# Altium schematic sheet tx_path.SchDoc: WULPUS PRO
size A4; DrawnBy: Sergei Vostrikov; Organization: Integrated Systems Laboratory; Revision: 1.0.0; SheetNumber: 3; SheetTotal: 8
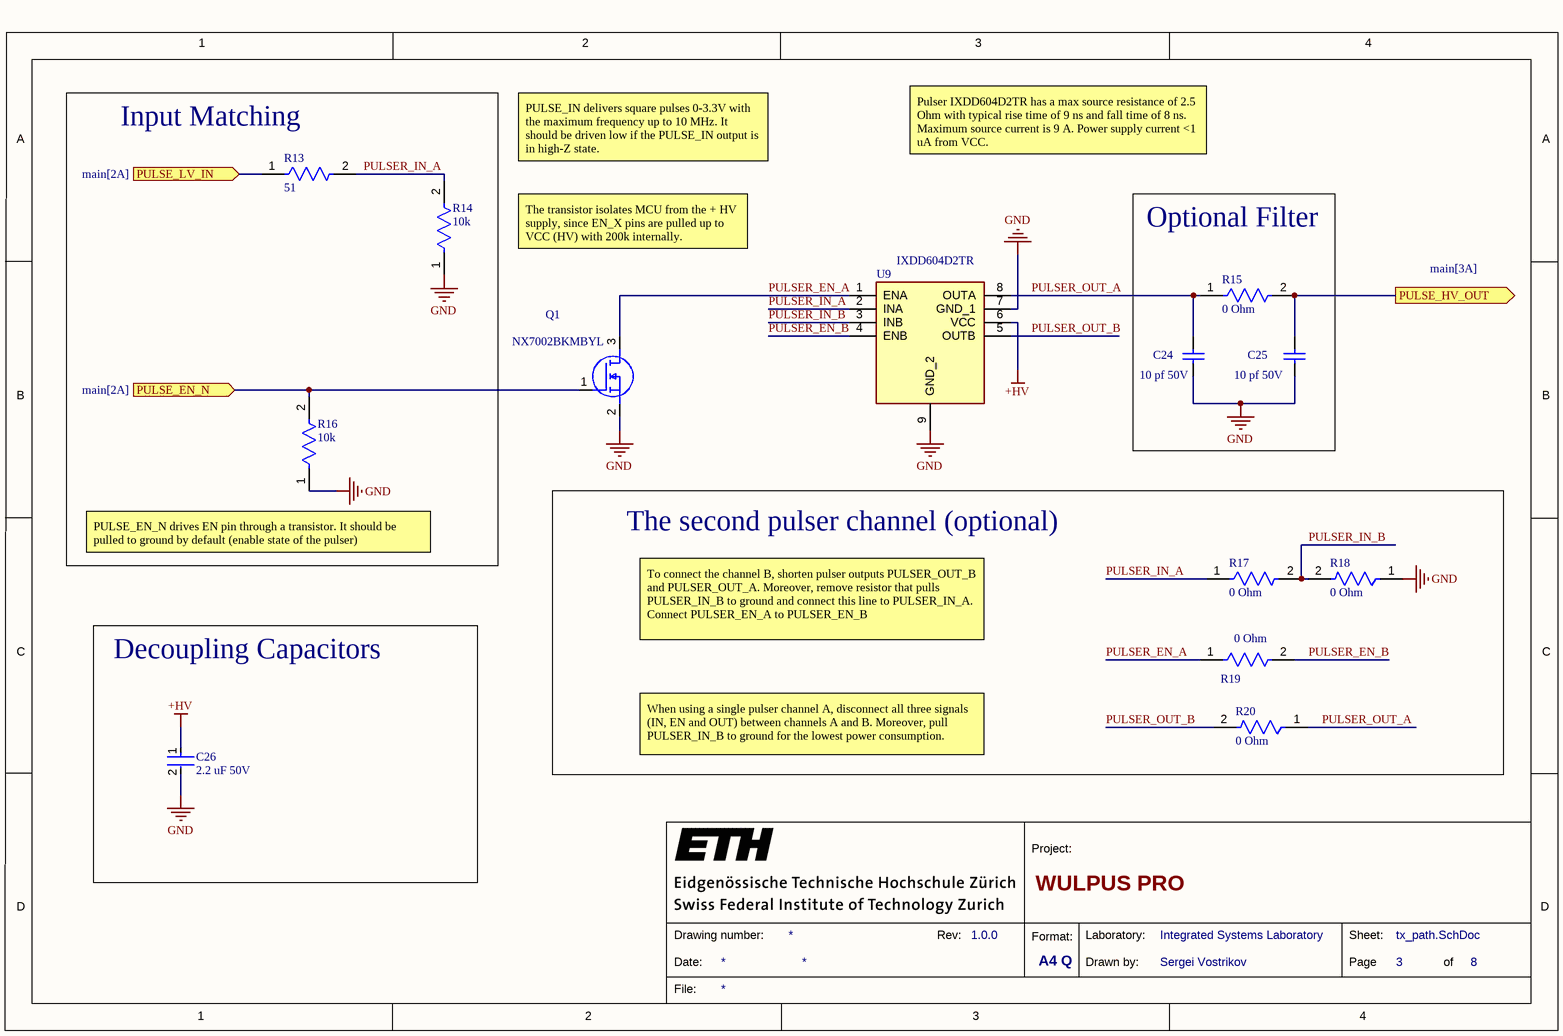
[diagram p0: tx_path.SchDoc]

## Parts
C24  10 pf 50V  [CAPC1005X55X25LL05T10]
C25  10 pf 50V  [CAPC1005X55X25LL05T10]
C26  2.2 uF 50V  [FP-GRM188-0_2-IPC_B]
Q1  NX7002BKMBYL  [NX7002BKMBYL]
R13  51  [FP-CRCW0402-e3-IPC_C]
R14  10k  [FP-CRCW0402-e3-IPC_B]
R15  0 Ohm  [FP-ERJ-3GEY0R00V-MFG]
R16  10k  [FP-CRCW0402-e3-IPC_B]
R17  0 Ohm  [FP-CRCW0402-e3-IPC_C]
R18  0 Ohm  [FP-CRCW0402-e3-IPC_C]
R19  0 Ohm  [FP-CRCW0402-e3-IPC_C]
R20  0 Ohm  [FP-CRCW0402-e3-IPC_C]
U9  IXDD604D2TR  [SON95P500X400X100-9N]

## Blocks framed on the sheet
Input Matching: R13 R14 R16
Optional Filter: C24 C25 R15
The second pulser channel (optional): R17-R20
Decoupling Capacitors: C26

## Ports
PULSE_EN_N (in, see main[2A]), PULSE_HV_OUT (out, see main[3A]), PULSE_LV_IN (in, see main[2A])

## Nets
+HV: C26.1 U9.6(VCC)
GND: C24.1 C25.1 C26.2 Q1.2(S) R14.1 R16.1 R18.1 U9.7(GND_1) U9.9(GND_2)
PULSE_EN_N: Q1.1(G) R16.2 ; port PULSE_EN_N
PULSE_HV_OUT: C25.2 R15.2 ; port PULSE_HV_OUT
PULSE_LV_IN: R13.1 ; port PULSE_LV_IN
PULSER_EN_A: Q1.3(D) R19.1 U9.1(ENA)
PULSER_EN_B: R19.2 U9.4(ENB)
PULSER_IN_A: R13.2 R14.2 R17.1 U9.2(INA)
PULSER_IN_B: R17.2 R18.2 U9.3(INB)
PULSER_OUT_A: C24.2 R15.1 R20.1 U9.8(OUTA)
PULSER_OUT_B: R20.2 U9.5(OUTB)

## Notes on the sheet
- PULSE_IN delivers square pulses 0-3.3V with the maximum frequency up to 10 MHz. It should be driven low if the PULSE_IN output is in high-Z state.
- Pulser IXDD604D2TR has a max source resistance of 2.5 Ohm with typical rise time of 9 ns and fall time of 8 ns. Maximum source current is 9 A. Power supply current <1 uA from VCC.
- The transistor isolates MCU from the + HV supply, since EN_X pins are pulled up to VCC (HV) with 200k internally.
- (near R16) PULSE_EN_N drives EN pin through a transistor. It should be pulled to ground by default (enable state of the pulser)
- To connect the channel B, shorten pulser outputs PULSER_OUT_B and PULSER_OUT_A. Moreover, remove resistor that pulls PULSER_IN_B to ground and connect this line to PULSER_IN_A. Connect PULSER_EN_A to PULSER_EN_B
- When using a single pulser channel A, disconnect all three signals (IN, EN and OUT) between channels A and B. Moreover, pull PULSER_IN_B to ground for the lowest power consumption.
- 1
- 2
- 3
- 4
- A
- B
- C
- Project:
- D
- Date:
- Drawing number:
- Rev:
- Format:
- A4 Q
- Drawn by:
- Laboratory:
- Page
- Sheet:
- of
- File:

## Library data of the parts
C24 C25 = CMP-2008-04245-1: GRM1555C1H100JA01D; Manufacturer: Murata; Part Number: GRM1555C1H100JA01D
C26 = CMP-06035-000704-1: GRM188R61H225ME11D; Capacitance: 2.2uF; Dielectric: X5R; Tolerance: 20%; Weight: 0.000222oz; Min Operating Temperature: -55°C; Voltage Rating (DC): 50V; Case Code (Imperial): 0603; Thickness: 0.039inch; Height: 0.8mm; Termination: SMD/SMT; Resistor Type: Ceramic; Case/Package: 0603; Package Quantity: 4000; Length: 0.063inch; Lead Free: Lead Free; Max Operating Temperature: 85°C; Packaging: Tape and Reel; Width: 0.031inch; Voltage Rating: 50V; Mount: Surface Mount; Case Code (Metric): 1608
Q1 = NX7002BKMBYL: MOSFET (N-Channel); Manufacturer_Name: Nexperia; Datasheet Link: https://assets.nexperia.com/documents/data-sheet/NX7002BKMB.pdf; Height: 0.4mm; Manufacturer_Part_Number: NX7002BKMBYL; Mouser Part Number: 771-NX7002BKMBYL; Mouser Price/Stock: https://www.mouser.co.uk/ProductDetail/Nexperia/NX7002BKMBYL?qs=%252BRKXB2WKlSdBDdfwQeVqTQ%3D%3D; Arrow Part Number: NX7002BKMBYL; Arrow Price/Stock: https://www.arrow.com/en/products/nx7002bkmbyl/nexperia?region=nac
R13 = CMP-2002-00083-2: CRCW040251R0JNED; Max Power Dissipation: 63mW; Temperature Coefficient: 200ppm/°C; Tolerance: 5%; Resistance: 51R; Voltage Rating: 50V; Depth: 0.5mm; Mount: Surface Mount; Number of Terminations: 2; Height: 0.35mm; Length: 1mm; Case Code (Metric): 1005; Radiation Hardening: No; Min Operating Temperature: -55°C; Termination: SMD/SMT; Military Standard: Not; Lead Free: Lead Free; Power Rating: 63mW; Max Operating Temperature: 155°C; Width: 0.5mm; Features: Automotive AEC-Q200; Weight: 2.3E-05oz; Case Code (Imperial): 0402; Package Quantity: 1; Number of Pins: 2; Case/Package: 0402; Contact Plating: Tin; Voltage Rating (DC): 50V; Packaging: Tape and Reel; Composition: Thick Film
R14 R16 = CMP-2002-08136-3: CRCW040210K0JNED; Temperature Coefficient: 200ppm/°C; Voltage Rating: 50V; Power Rating: 63mW; Resistance: 10kR; Tolerance: 5%; Military Standard: Not; Packaging: Tape and Reel; Case Code (Imperial): 0402; Min Operating Temperature: -55°C; Case Code (Metric): 1005; Case/Package: 0402; Termination: SMD/SMT; Composition: Thick Film; Depth: 0.5mm; Number of Terminations: 2; Contact Plating: Tin; Height: 0.016inch; Width: 0.5mm; Max Operating Temperature: 155°C; Features: Automotive AEC-Q200; Length: 1mm; Radiation Hardening: No; Max Power Dissipation: 63mW; Mount: Surface Mount; Package Quantity: 1; Weight: 2.3E-05oz
R15 = CMP-2000-00700-2: ERJ-3GEY0R00V; Manufacturer: Panasonic; Tolerance: 5%; Automotive Grade: Grade 0; Voltage Rating: 75V; Value: 0Ω; Temperature Coefficient: -100/+600ppm/°C; Power Rating: 0.1W; Mouser Description: Resistor, Chip Thick Film, 0 Ohm, 0.1w, Resistor, Chip Thick Film, 0 Ohm, 0.1w, 5%; Manufacturer Part Number: ERJ-3GEY0R00V; Ipc Land Pattern Name: RESC16080X45; Category: Res; Package: 0603; Temperature: -55°C to +155°C; Temperature Range Low: -55°C; Series: ERJ; Resistance: 0Ω; RoHS: TRUE; Composition: Thick Film; Octopart: https://octopart.com/erj-3gey0r00v-panasonic-55389238; Device Class L1: Passive Components; Footprint Url: https://industrial.panasonic.com/cdbs/www-data/pdf/RDA0000/DMA0000COL17.pdf; ComponentLink2Description: Datasheet; Device Class L2: Resistors; Temperature Range High: +155°C; Digikey Description: RES SMD 0 OHM JUMPER 1/10W 0603; Lead Free: Yes; Device Class L3: Chip SMD Resistors; Height: 0.55mm; ComponentLink2URL: https://industrial.panasonic.com/cdbs/www-data/pdf/RDA0000/AOA0000C301.pdf; Automotive: Yes
R17-R20 = CMP-2002-08122-2: CRCW04020000Z0ED; Tolerance: 5%; Max Power Dissipation: 63mW; Voltage Rating: 50V; Temperature Coefficient: 100ppm/°C; Resistance: 0mR; Contact Plating: Tin; Height: 0.35mm; Radiation Hardening: No; Features: Automotive AEC-Q200; Composition: Thick Film; Width: 0.5mm; Weight: 2.3E-05oz; Termination: SMD/SMT; Packaging: Tape and Reel; Mount: Surface Mount; Case Code (Metric): 1005; Military Standard: Not; Min Operating Temperature: -55°C; Number of Terminations: 2; Package Quantity: 1; Case Code (Imperial): 0402; Depth: 0.5mm; Max Operating Temperature: 155°C; Case/Package: 0402; Power Rating: 63mW; Lead Free: Lead Free; Voltage Rating (DC): 50V; Length: 1mm
U9 = IXDD604D2TR: Integrated Circuit; Manufacturer_Name: LITTELFUSE; Datasheet Link: http://www.ixysic.com/home/pdfs.nsf/www/IXD_604.pdf/$file/IXD_604.pdf; Height: 1mm; Manufacturer_Part_Number: IXDD604D2TR; Mouser Part Number: 849-IXDD604D2TR; Mouser Price/Stock: https://www.mouser.co.uk/ProductDetail/IXYS-Integrated-Circuits/IXDD604D2TR?qs=RF%252Bx3zajg8LeQlBgW9OO7w%3D%3D; Arrow Part Number: IXDD604D2TR; Arrow Price/Stock: https://www.arrow.com/en/products/ixdd604d2tr/ixys